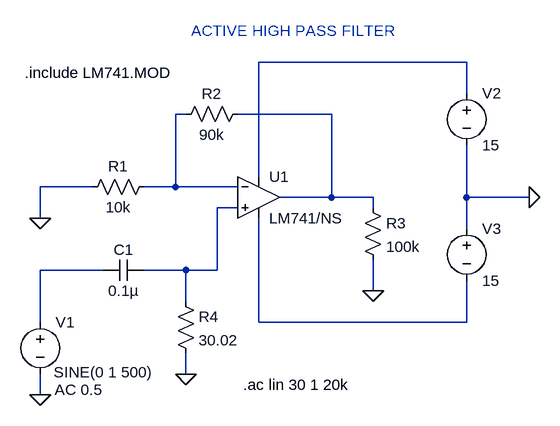
[diagram p0: schematic Active HPF.asc]
Active HPF.asc, the LTspice schematic file:
Version 4
SHEET 1 880 680
WIRE 736 -80 416 -80
WIRE 736 -32 736 -80
WIRE 304 0 288 0
WIRE 528 0 384 0
WIRE 416 96 416 -80
WIRE 160 112 80 112
WIRE 288 112 288 0
WIRE 288 112 240 112
WIRE 384 112 288 112
WIRE 528 128 528 0
WIRE 528 128 448 128
WIRE 592 128 528 128
WIRE 736 128 736 48
WIRE 832 128 736 128
WIRE 384 144 352 144
WIRE 592 144 592 128
WIRE 80 160 80 112
WIRE 736 176 736 128
WIRE 176 240 80 240
WIRE 304 240 240 240
WIRE 352 240 352 144
WIRE 352 240 304 240
WIRE 592 272 592 224
WIRE 304 288 304 240
WIRE 80 320 80 240
WIRE 416 320 416 160
WIRE 736 320 736 256
WIRE 736 320 416 320
WIRE 304 400 304 368
WIRE 80 432 80 400
FLAG 80 160 0
FLAG 304 400 0
FLAG 592 272 0
FLAG 80 432 0
FLAG 832 128 0
SYMBOL res 256 96 R90
WINDOW 0 0 56 VBottom 2
WINDOW 3 32 56 VTop 2
SYMATTR InstName R1
SYMATTR Value 10k
SYMBOL cap 240 224 R90
WINDOW 0 0 32 VBottom 2
WINDOW 3 32 32 VTop 2
SYMATTR InstName C1
SYMATTR Value 0.1µ
SYMBOL res 288 272 R0
SYMATTR InstName R4
SYMATTR Value 30.02
SYMBOL res 576 128 R0
SYMATTR InstName R3
SYMATTR Value 100k
SYMBOL OpAmps\\opamp2 416 64 R0
SYMATTR InstName U1
SYMATTR Value LM741/NS
SYMBOL voltage 80 304 R0
WINDOW 3 21 93 Left 2
WINDOW 123 22 120 Left 2
WINDOW 39 0 0 Left 0
SYMATTR Value SINE(0 1 500)
SYMATTR Value2 AC 0.5
SYMATTR InstName V1
SYMBOL res 400 -16 R90
WINDOW 0 0 56 VBottom 2
WINDOW 3 32 56 VTop 2
SYMATTR InstName R2
SYMATTR Value 90k
SYMBOL voltage 736 -48 R0
SYMATTR InstName V2
SYMATTR Value 15
SYMBOL voltage 736 160 R0
SYMATTR InstName V3
SYMATTR Value 15
TEXT 56 -64 Left 2 !.include LM741.MOD
TEXT 392 416 Left 2 !.ac lin 30 1 20k
TEXT 312 -128 Left 2 ;ACTIVE HIGH PASS FILTER

The netlist it stands for:
* Active HPF.asc
R1 N002 0 10k
C1 N004 N005 0.1µ
R4 N004 0 30.02
R3 N003 0 100k
XU1 N004 N002 N001 N006 N003 LM741/NS  ; pins In+ In- V+ V- OUT
V1 N005 0 SINE(0 1 500) AC 0.5
R2 N003 N002 90k
V2 N001 0 15
V3 0 N006 15
.include LM741.MOD
.ac lin 30 1 20k
* ACTIVE HIGH PASS FILTER
.backanno
.end